# Altium schematic sheet Filtro.SchDoc
size A4
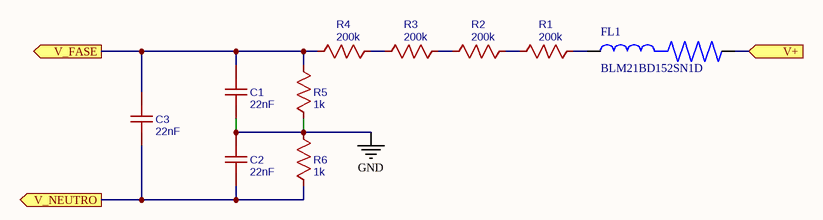
[diagram p0: Filtro.SchDoc]

## Parts
C1  22nF  [CAPC3216X190]
C2  22nF  [CAPC3216X190]
C3  22nF  [CAPC3216X190]
FL1  BLM21BD152SN1D  [BEADC2012X105N]
R1  200k  [RESC3216X75N]
R2  200k  [RESC3216X75N]
R3  200k  [RESC3216X75N]
R4  200k  [RESC3216X75N]
R5  1k  [RESC3216X75N]
R6  1k  [RESC3216X75N]

## Ports
V+ (in), V_FASE (out), V_NEUTRO (out)

## Nets
GND: C1.1 C2.2 R5.1 R6.2
V+: FL1.2 ; port V+
V_FASE: C1.2 C3.2 R4.1 R5.2 ; port V_FASE
V_NEUTRO: C2.1 C3.1 R6.1 ; port V_NEUTRO
NetFL1_1: FL1.1 R1.2
NetR1_1: R1.1 R2.2
NetR2_1: R2.1 R3.2
NetR3_1: R3.1 R4.2

## Library data of the parts
C1-C3 = 22nF: nameAlias: Value(F); spicePre: C; spiceSymbolName: Cap_RAD-0.1_US
FL1 = BLM21BD152SN1D: 1.5 kOhms @ 100MHz 1 Signal Line Ferrite Bead 0805 (2012 Metric) 250mA 450mOhm; MF: Murata; Availability: Good; Check_prices: https://www.snapeda.com/parts/BLM21BD152SN1D/Murata/view-part/290529/?ref=eda; Value: *; Package: 2012 Murata; MP: BLM21BD152SN1D; Price: None; SnapEDA_Link: https://www.snapeda.com/parts/BLM21BD152SN1D/Murata/view-part/290529/?ref=snap; Purchase-URL: https://pricing.snapeda.com/search/part/BLM21BD152SN1D/?ref=eda
R1-R4 = 330k: nameAlias: Value(Ω); spicePre: R; spiceSymbolName: Res_AXIAL-0.3(1/8W)_US
R5 R6 = 1k: nameAlias: Value(Ω); spicePre: R; spiceSymbolName: Res_AXIAL-0.3(1/8W)_US